# Altium project Stairs_control_Project.PrjPCB
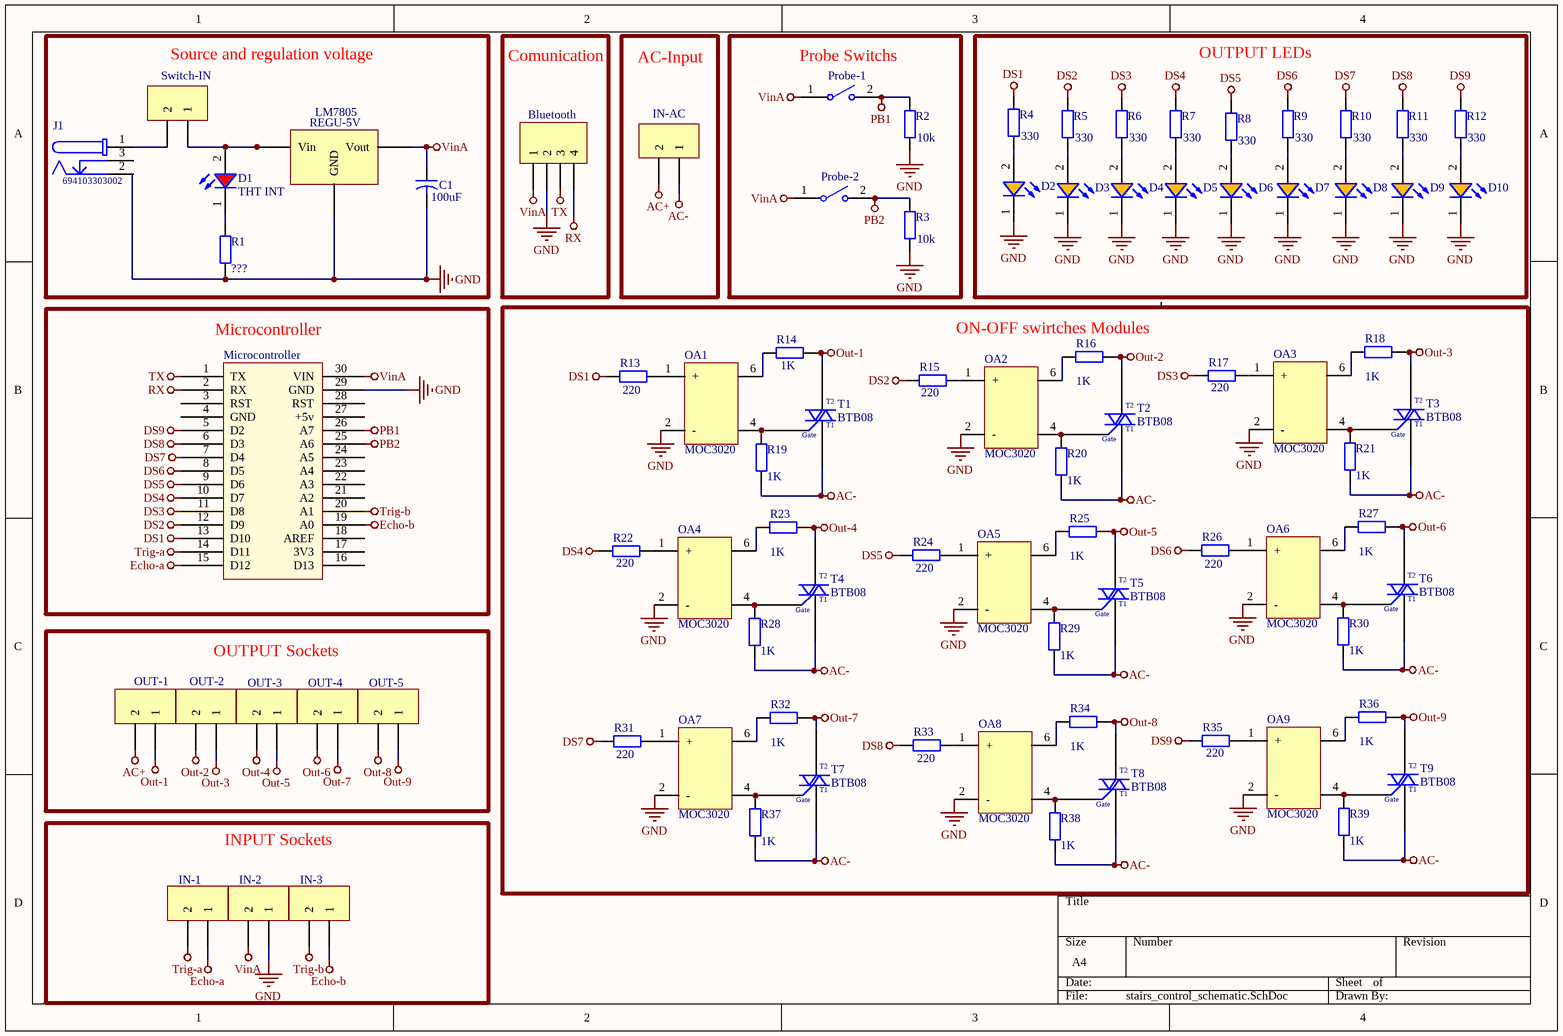
[diagram p0: stairs_control_schematic.SchDoc]
1 sheet, 84 parts. Net scope: global (net labels, ports and power ports of the same name join across sheets).
Board file: Stairs_control_PCB.PcbDoc

## Sheet stairs_control_schematic.SchDoc
size A4

### Parts
Bluetooth  Bluetooth  [HDR1X4]  (value not drawn)
C1  value 100uF  [CAPR5-4X5]
D1  THT INT  [WL-TMRC_3mm]
D2  SMD  [WL-SMCW_0603_H=0.7mm]  (value not drawn)
D3  SMD  [WL-SMCW_0603_H=0.7mm]  (value not drawn)
D4  SMD  [WL-SMCW_0603_H=0.7mm]  (value not drawn)
D5  SMD  [WL-SMCW_0603_H=0.7mm]  (value not drawn)
D6  SMD  [WL-SMCW_0603_H=0.7mm]  (value not drawn)
D7  SMD  [WL-SMCW_0603_H=0.7mm]  (value not drawn)
D8  SMD  [WL-SMCW_0603_H=0.7mm]  (value not drawn)
D9  SMD  [WL-SMCW_0603_H=0.7mm]  (value not drawn)
D10  SMD  [WL-SMCW_0603_H=0.7mm]  (value not drawn)
IN-1  Terminal Block 2  [Terminal Block 2]  (value not drawn)
IN-2  Terminal Block 2  [Terminal Block 2]  (value not drawn)
IN-3  Terminal Block 2  [Terminal Block 2]  (value not drawn)
IN-AC  Terminal Block 2  [Terminal Block 2]  (value not drawn)
J1  694103303002  [694103303002]
Microcontroller  ArduinoNano  [ArduinoNano]  (value not drawn)
OA1  MOC3020  [PCBComponent_1]
OA2  MOC3020  [PCBComponent_1]
OA3  MOC3020  [PCBComponent_1]
OA4  MOC3020  [PCBComponent_1]
OA5  MOC3020  [PCBComponent_1]
OA6  MOC3020  [PCBComponent_1]
OA7  MOC3020  [PCBComponent_1]
OA8  MOC3020  [PCBComponent_1]
OA9  MOC3020  [PCBComponent_1]
OUT-1  Terminal Block 2  [Terminal Block 2]  (value not drawn)
OUT-2  Terminal Block 2  [Terminal Block 2]  (value not drawn)
OUT-3  Terminal Block 2  [Terminal Block 2]  (value not drawn)
OUT-4  Terminal Block 2  [Terminal Block 2]  (value not drawn)
OUT-5  Terminal Block 2  [Terminal Block 2]  (value not drawn)
Probe-1  Probe-1  [434111043826]  (value not drawn)
Probe-2  Probre-2  [434111043826]  (value not drawn)
R1  value ???  [AXIAL-0.4]  (hidden comment: Res2)
R2  10k  [WRIS-KSKE_0805_H=0.6mm]
R3  10k  [WRIS-KSKE_0805_H=0.6mm]
R4  330  [WRIS-KSKE_0805_H=0.6mm]
R5  330  [WRIS-KSKE_0805_H=0.6mm]
R6  330  [WRIS-KSKE_0805_H=0.6mm]
R7  330  [WRIS-KSKE_0805_H=0.6mm]
R8  330  [WRIS-KSKE_0805_H=0.6mm]
R9  330  [WRIS-KSKE_0805_H=0.6mm]
R10  330  [WRIS-KSKE_0805_H=0.6mm]
R11  330  [WRIS-KSKE_0805_H=0.6mm]
R12  330  [WRIS-KSKE_0805_H=0.6mm]
R13  value 220  [AXIAL-0.4]  (hidden comment: Res2)
R14  value 1K  [AXIAL-0.4]  (hidden comment: Res2)
R15  value 220  [AXIAL-0.4]  (hidden comment: Res2)
R16  value 1K  [AXIAL-0.4]  (hidden comment: Res2)
R17  value 220  [AXIAL-0.4]  (hidden comment: Res2)
R18  value 1K  [AXIAL-0.4]  (hidden comment: Res2)
R19  value 1K  [AXIAL-0.4]  (hidden comment: Res2)
R20  value 1K  [AXIAL-0.4]  (hidden comment: Res2)
R21  value 1K  [AXIAL-0.4]  (hidden comment: Res2)
R22  value 220  [AXIAL-0.4]  (hidden comment: Res2)
R23  value 1K  [AXIAL-0.4]  (hidden comment: Res2)
R24  value 220  [AXIAL-0.4]  (hidden comment: Res2)
R25  value 1K  [AXIAL-0.4]  (hidden comment: Res2)
R26  value 220  [AXIAL-0.4]  (hidden comment: Res2)
R27  value 1K  [AXIAL-0.4]  (hidden comment: Res2)
R28  value 1K  [AXIAL-0.4]  (hidden comment: Res2)
R29  value 1K  [AXIAL-0.4]  (hidden comment: Res2)
R30  value 1K  [AXIAL-0.4]  (hidden comment: Res2)
R31  value 220  [AXIAL-0.4]  (hidden comment: Res2)
R32  value 1K  [AXIAL-0.4]  (hidden comment: Res2)
R33  value 220  [AXIAL-0.4]  (hidden comment: Res2)
R34  value 1K  [AXIAL-0.4]  (hidden comment: Res2)
R35  value 220  [AXIAL-0.4]  (hidden comment: Res2)
R36  value 1K  [AXIAL-0.4]  (hidden comment: Res2)
R37  value 1K  [AXIAL-0.4]  (hidden comment: Res2)
R38  value 1K  [AXIAL-0.4]  (hidden comment: Res2)
R39  value 1K  [AXIAL-0.4]  (hidden comment: Res2)
REGU-5V  LM7805  [LM7805]
Switch-IN  Terminal Block 2  [Terminal Block 2]  (value not drawn)
T1  BTB08  [LM7805]
T2  BTB08  [LM7805]
T3  BTB08  [LM7805]
T4  BTB08  [LM7805]
T5  BTB08  [LM7805]
T6  BTB08  [LM7805]
T7  BTB08  [LM7805]
T8  BTB08  [LM7805]
T9  BTB08  [LM7805]

### Blocks framed on the sheet
Source and regulation voltage: C1 D1 J1 R1 REGU-5V Switch-IN
Comunication: Bluetooth
AC-Input: IN-AC
Probe Switchs: Probe-1 Probe-2 R2 R3
OUTPUT LEDs: D2-D10 R4-R12
Microcontroller: Microcontroller
ON-OFF swirtches Modules: OA1-OA9 R13-R39 T1-T9
OUTPUT Sockets: OUT-1-OUT-5
INPUT Sockets: IN-1-IN-3

### Nets
AC+: IN-AC.2 OUT-1.2
AC-: IN-AC.1 R19.1 R20.1 R21.1 R28.1 R29.1 R30.1 R37.1 R38.1 R39.1 T1.1(T1) T2.1(T1) T3.1(T1) T4.1(T1) T5.1(T1) T6.1(T1) T7.1(T1) T8.1(T1) T9.1(T1)
DS1: Microcontroller.13(D10) R4.2 R13.2
DS2: Microcontroller.12(D9) R5.2 R15.2
DS3: Microcontroller.11(D8) R6.2 R17.2
DS4: Microcontroller.10(D7) R7.2 R22.2
DS5: Microcontroller.9(D6) R8.2 R24.2
DS6: Microcontroller.8(D5) R9.2 R26.2
DS7: Microcontroller.7(D4) R10.2 R31.2
DS8: Microcontroller.6(D3) R11.2 R33.2
DS9: Microcontroller.5(D2) R12.2 R35.2
Echo-a: IN-1.1 Microcontroller.15(D12)
Echo-b: IN-3.1 Microcontroller.19(A0)
GND: Bluetooth.2 C1.2 D2.1(K) D3.1(K) D4.1(K) D5.1(K) D6.1(K) D7.1(K) D8.1(K) D9.1(K) D10.1(K) IN-2.1 J1.2 Microcontroller.29(GND) OA1.2(-) OA2.2(-) OA3.2(-) OA4.2(-) OA5.2(-) OA6.2(-) OA7.2(-) OA8.2(-) OA9.2(-) R1.1 R2.1 R3.1 REGU-5V.2(GND)
Out-1: OUT-1.1 R14.2 T1.2(T2)
Out-2: OUT-2.2 R16.2 T2.2(T2)
Out-3: OUT-2.1 R18.2 T3.2(T2)
Out-4: OUT-3.2 R23.2 T4.2(T2)
Out-5: OUT-3.1 R25.2 T5.2(T2)
Out-6: OUT-4.2 R27.2 T6.2(T2)
Out-7: OUT-4.1 R32.2 T7.2(T2)
Out-8: OUT-5.2 R34.2 T8.2(T2)
Out-9: OUT-5.1 R36.2 T9.2(T2)
PB1: Microcontroller.26(A7) Probe-1.2 R2.2
PB2: Microcontroller.25(A6) Probe-2.2 R3.2
RX: Bluetooth.4 Microcontroller.2(RX)
Trig-a: IN-1.2 Microcontroller.14(D11)
Trig-b: IN-3.2 Microcontroller.20(A1)
TX: Bluetooth.3 Microcontroller.1(TX)
VinA: Bluetooth.1 C1.1 IN-2.2 Microcontroller.30(VIN) Probe-1.1 Probe-2.1 REGU-5V.3(Vout)
NetD1_1: D1.1(K) R1.2
NetD1_2: D1.2(A) REGU-5V.1(Vin) Switch-IN.1
NetD2_2: D2.2(A) R4.1
NetD3_2: D3.2(A) R5.1
NetD4_2: D4.2(A) R6.1
NetD5_2: D5.2(A) R7.1
NetD6_2: D6.2(A) R8.1
NetD7_2: D7.2(A) R9.1
NetD8_2: D8.2(A) R10.1
NetD9_2: D9.2(A) R11.1
NetD10_2: D10.2(A) R12.1
NetJ1_1: J1.1 Switch-IN.2
NetOA1_1: OA1.1(+) R13.1
NetOA1_4: OA1.4 R19.2 T1.3(Gate)
NetOA1_6: OA1.6 R14.1
NetOA2_1: OA2.1(+) R15.1
NetOA2_4: OA2.4 R20.2 T2.3(Gate)
NetOA2_6: OA2.6 R16.1
NetOA3_1: OA3.1(+) R17.1
NetOA3_4: OA3.4 R21.2 T3.3(Gate)
NetOA3_6: OA3.6 R18.1
NetOA4_1: OA4.1(+) R22.1
NetOA4_4: OA4.4 R28.2 T4.3(Gate)
NetOA4_6: OA4.6 R23.1
NetOA5_1: OA5.1(+) R24.1
NetOA5_4: OA5.4 R29.2 T5.3(Gate)
NetOA5_6: OA5.6 R25.1
NetOA6_1: OA6.1(+) R26.1
NetOA6_4: OA6.4 R30.2 T6.3(Gate)
NetOA6_6: OA6.6 R27.1
NetOA7_1: OA7.1(+) R31.1
NetOA7_4: OA7.4 R37.2 T7.3(Gate)
NetOA7_6: OA7.6 R32.1
NetOA8_1: OA8.1(+) R33.1
NetOA8_4: OA8.4 R38.2 T8.3(Gate)
NetOA8_6: OA8.6 R34.1
NetOA9_1: OA9.1(+) R35.1
NetOA9_4: OA9.4 R39.2 T9.3(Gate)
NetOA9_6: OA9.6 R36.1

Not connected (* = marked no-connect by the designer): J1 3; Microcontroller 3(RST) 4(GND) 16(D13) 17(3V3) 18(AREF) 21(A2) 22(A3) 23(A4) 24(A5) 27(+5v) 28(RST)

### Library data of the parts
Bluetooth = Header 4: Header, 4-Pin; LatestRevisionDate: 17-Jul-2002; LatestRevisionNote: Re-released for DXP Platform.; Publisher: Altium Limited
C1 = Cap2: Capacitor; Published: 23-Sep-2002; PackageReference: CAPR5-4X5; Publisher: Altium Limited; PackageDescription: Capacitor; 2 Leads
D1 = 151031SS04000: WL-TMRC THT Mono-color Round Color, size 3mm, Super Red, 2V, 40deg; Luminous Intensity: 160mcd; Dominant Wavelength: 635nm; Peak Wavelength: 640nm; Chip Technology: AlInGaP; ComponentLink1Description: Manufacturer; ComponentLink1URL: http://www.we-online.de; ComponentLink2Description: Datasheet; ComponentLink2URL: https://katalog.we-online.de/led/datasheet/151031SS04000.pdf; Emitting Color: Super Red; Operating Temperature: -40 to +85degC; Mounting Technology: THT; Forward Voltage: 2V; Part Number: 151031SS04000; Packaging: Bulk; Published Date: October 2019; Publisher: Wurth Elektronik; Size: 3mm; Viewing Angle: 40deg
D2-D10 = 150060AS75000: WL-SMCW SMT Mono-color Chip LED Waterclear, size 0603, Amber, 2V, 140deg; Chip Technology: AlInGaP; Dominant Wavelength typ.: 605nm; Luminous Intensity typ.: 130mcd; Peak Wavelength typ.: 610nm; Viewing Angle: 140deg; ComponentLink1Description: Manufacturer; ComponentLink1URL: http://www.we-online.de; ComponentLink2URL: https://www.we-online.com/catalog/datasheet/150060AS75000.pdf; ComponentLink2Description: Datasheet; Forward Voltage typ.: 2V; Emitting Color: Amber; Mounting Technology: SMT; Operating Temperature: -40 to +85degC; Published Date: December 2019; Part Number: 150060AS75000; Packaging: Tape and Reel; Size: 0603; Publisher: Wurth Elektronik
IN-1-IN-3 IN-AC OUT-1-OUT-5 Switch-IN = TB2
J1 = 694103303002: DC Power Jack Connector WR-DC, Male, Right Angled, THT, 2 A, 30 V; Opening Diameter: 4.2 mm; Plug Inner Diameter: 1.35 mm; Plug Outer Diameter: 3.5 mm; Rated Current: 2 A; Working Voltage: 30 V; ComponentLink1Description: Manufacturer; ComponentLink1URL: http://www.we-online.de; ComponentLink2Description: Datasheet; ComponentLink2URL: http://katalog.we-online.de/em/datasheet/6941xx303002.pdf; Part Number: 694103303002; Published Date: August 2018; Publisher: Wurth Elektronik; Orientation: Right Angled; Operating Temperature: -40 to 85 degC; Mounting Technology: THT; Gender: Male; Packaging: Bag
Microcontroller = ArduinoNano: Arduino nano chino
Probe-1 Probe-2 = 434111043826: WS-TASV SMT Tact Switch 6x3.5mm, height 4.3mm, 260gf; Rated Voltage: 12VDC; Rated Current: 50mA; Washable: No; ComponentLink1Description: Manufacturer; ComponentLink1URL: http://www.we-online.de; ComponentLink2Description: Datasheet; ComponentLink2URL: https://katalog.we-online.com/em/datasheet/434111043826.pdf; Operating Temperature: -40 to +85degC; Part Number: 434111043826; Published Date: September 2019; Contact Material: Stainless Steel; Height: 4.3mm; Mounting Technology: SMT; Contact Plating: Silver; Operation Force: 260gf; Packaging: Tape and Reel; Terminal Material: Copper Alloy; Publisher: Wurth Elektronik; Terminal Plating: Silver
R1 R13-R39 = Res2: Resistor; Published: 8-Jun-2000; LatestRevisionDate: 17-Jul-2002; LatestRevisionNote: Re-released for DXP Platform.; PackageReference: AXIAL-0.4; Publisher: Altium Limited; PackageDescription: Axial Device, Thru-Hole; 2 Leads; 0.4 in Pin Spacing
R2-R12 = 560050320001: WRIS-KSKE Thick Film Resistors, size 0805, 0.1Ohm, +/-1%, 0.33W; Rated Current: 1.81A; Temperature Coefficient of Resistance: 250ppm/degC; Technical Reference: KE0805R100F103LAATP0000; ComponentLink1Description: Manufacturer; ComponentLink1URL: http://www.we-online.de; ComponentLink2Description: Datasheet; ComponentLink2URL: https://katalog.we-online.com/pbs/datasheet/560050320001.pdf; Publisher: Wurth Elektronik; Rated Power: 0.33W; Resistance: 0.1Ohm; Mounting Technology: SMT; Height: 0.6mm; Part Number: 560050320001; Packaging: Tape and Reel; Published Date: September 2019; Size: 0805; Length: 2mm; Operating Temperature: -55 to +155degC; Resistance Tolerance: +/-1%; Width: 1.25mm